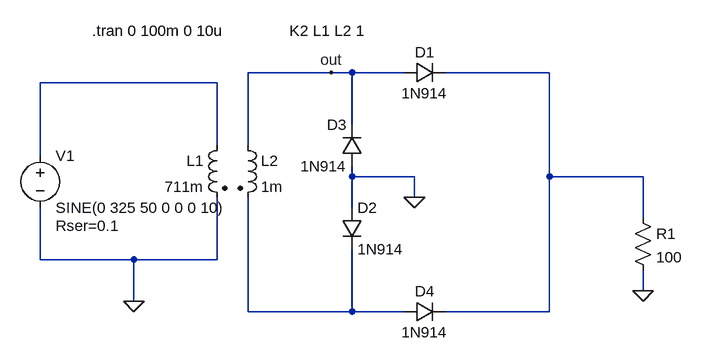
[diagram p0: schematic priklad4.asc]
priklad4.asc, the LTspice schematic file:
Version 4
SHEET 1 880 680
WIRE -352 -320 -480 -320
WIRE -320 -320 -352 -320
WIRE -240 -320 -320 -320
WIRE -16 -320 -176 -320
WIRE -528 -304 -800 -304
WIRE -320 -240 -320 -320
WIRE -528 -208 -528 -304
WIRE -480 -208 -480 -320
WIRE -800 -192 -800 -304
WIRE -320 -160 -320 -176
WIRE -224 -160 -320 -160
WIRE -16 -160 -16 -320
WIRE 128 -160 -16 -160
WIRE -224 -128 -224 -160
WIRE -320 -112 -320 -160
WIRE 128 -96 128 -160
WIRE -800 -32 -800 -112
WIRE -656 -32 -800 -32
WIRE -528 -32 -528 -128
WIRE -528 -32 -656 -32
WIRE 128 16 128 -16
WIRE -656 32 -656 -32
WIRE -480 48 -480 -128
WIRE -320 48 -320 -48
WIRE -320 48 -480 48
WIRE -240 48 -320 48
WIRE -16 48 -16 -160
WIRE -16 48 -176 48
FLAG -656 32 0
FLAG -352 -320 out
FLAG -224 -128 0
FLAG 128 16 0
SYMBOL voltage -800 -208 R0
WINDOW 123 0 0 Left 2
WINDOW 39 24 124 Left 2
SYMATTR InstName V1
SYMATTR Value SINE(0 325 50 0 0 0 10)
SYMATTR SpiceLine Rser=0.1
SYMBOL diode -240 -304 R270
WINDOW 0 32 32 VTop 2
WINDOW 3 0 32 VBottom 2
SYMATTR InstName D1
SYMATTR Value 1N914
SYMBOL ind2 -512 -224 M0
SYMATTR InstName L1
SYMATTR Value 711m
SYMATTR Type ind
SYMBOL ind2 -496 -224 R0
SYMATTR InstName L2
SYMATTR Value 1m
SYMATTR Type ind
SYMBOL diode -336 -112 R0
SYMATTR InstName D2
SYMATTR Value 1N914
SYMBOL diode -304 -176 R180
WINDOW 0 24 64 Left 2
WINDOW 3 24 0 Left 2
SYMATTR InstName D3
SYMATTR Value 1N914
SYMBOL diode -240 64 R270
WINDOW 0 32 32 VTop 2
WINDOW 3 0 32 VBottom 2
SYMATTR InstName D4
SYMATTR Value 1N914
SYMBOL res 112 -112 R0
SYMATTR InstName R1
SYMATTR Value 100
TEXT -720 -384 Left 2 !.tran 0 100m 0 10u
TEXT -416 -384 Left 2 !K2 L1 L2 1

The netlist it stands for:
* priklad4.asc
V1 N002 0 SINE(0 325 50 0 0 0 10) Rser=0.1
D1 out N001 1N914
L1 N002 0 711m
L2 out N003 1m
D2 0 N003 1N914
D3 0 out 1N914
D4 N003 N001 1N914
R1 N001 0 100
.model D D
.lib standard.dio
.tran 0 100m 0 10u
K2 L1 L2 1
.backanno
.end